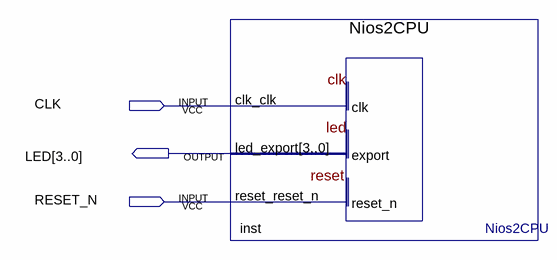
[diagram p0: schematic sheet]
// Quartus schematic CPU_Nios2.bdf as structural Verilog: 1 symbols, 3 pins
module CPU_Nios2 (
  input  CLK,
  input  RESET_N,
  output [3:0] LED
);

  Nios2CPU inst (.clk_clk(CLK), .reset_reset_n(RESET_N), .led_export(LED));
endmodule
